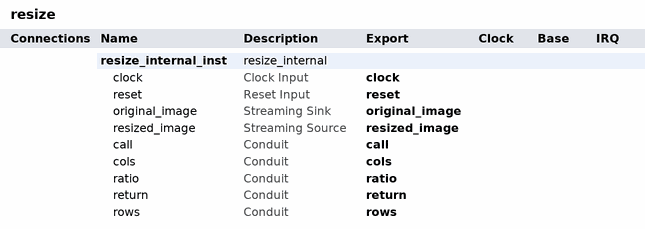
[diagram p0: system contents]
# Platform Designer (Qsys) system resize, Cyclone V 5CEFA9F23I7
# Parameters at their usual value, and those the tool derives, are not listed.
package require qsys
create_system resize
set_project_property DEVICE_FAMILY {Cyclone V}
set_project_property DEVICE 5CEFA9F23I7

add_instance resize_internal_inst resize_internal 1.0
set_instance_property resize_internal_inst AUTO_EXPORT true

# exported interfaces
add_interface call conduit end
set_interface_property call EXPORT_OF resize_internal_inst.call
add_interface clock clock sink
set_interface_property clock EXPORT_OF resize_internal_inst.clock
add_interface cols conduit end
set_interface_property cols EXPORT_OF resize_internal_inst.cols
add_interface original_image avalon_streaming sink
set_interface_property original_image EXPORT_OF resize_internal_inst.original_image
add_interface ratio conduit end
set_interface_property ratio EXPORT_OF resize_internal_inst.ratio
add_interface reset reset sink
set_interface_property reset EXPORT_OF resize_internal_inst.reset
add_interface resized_image avalon_streaming source
set_interface_property resized_image EXPORT_OF resize_internal_inst.resized_image
add_interface return conduit end
set_interface_property return EXPORT_OF resize_internal_inst.return
add_interface rows conduit end
set_interface_property rows EXPORT_OF resize_internal_inst.rows

set_interconnect_requirement {$system} qsys_mm.clockCrossingAdapter HANDSHAKE
set_interconnect_requirement {$system} qsys_mm.enableEccProtection FALSE
set_interconnect_requirement {$system} qsys_mm.insertDefaultSlave FALSE
set_interconnect_requirement {$system} qsys_mm.maxAdditionalLatency 1

save_system resize.qsys
